# Altium project NGNIv1_32.PrjPcb
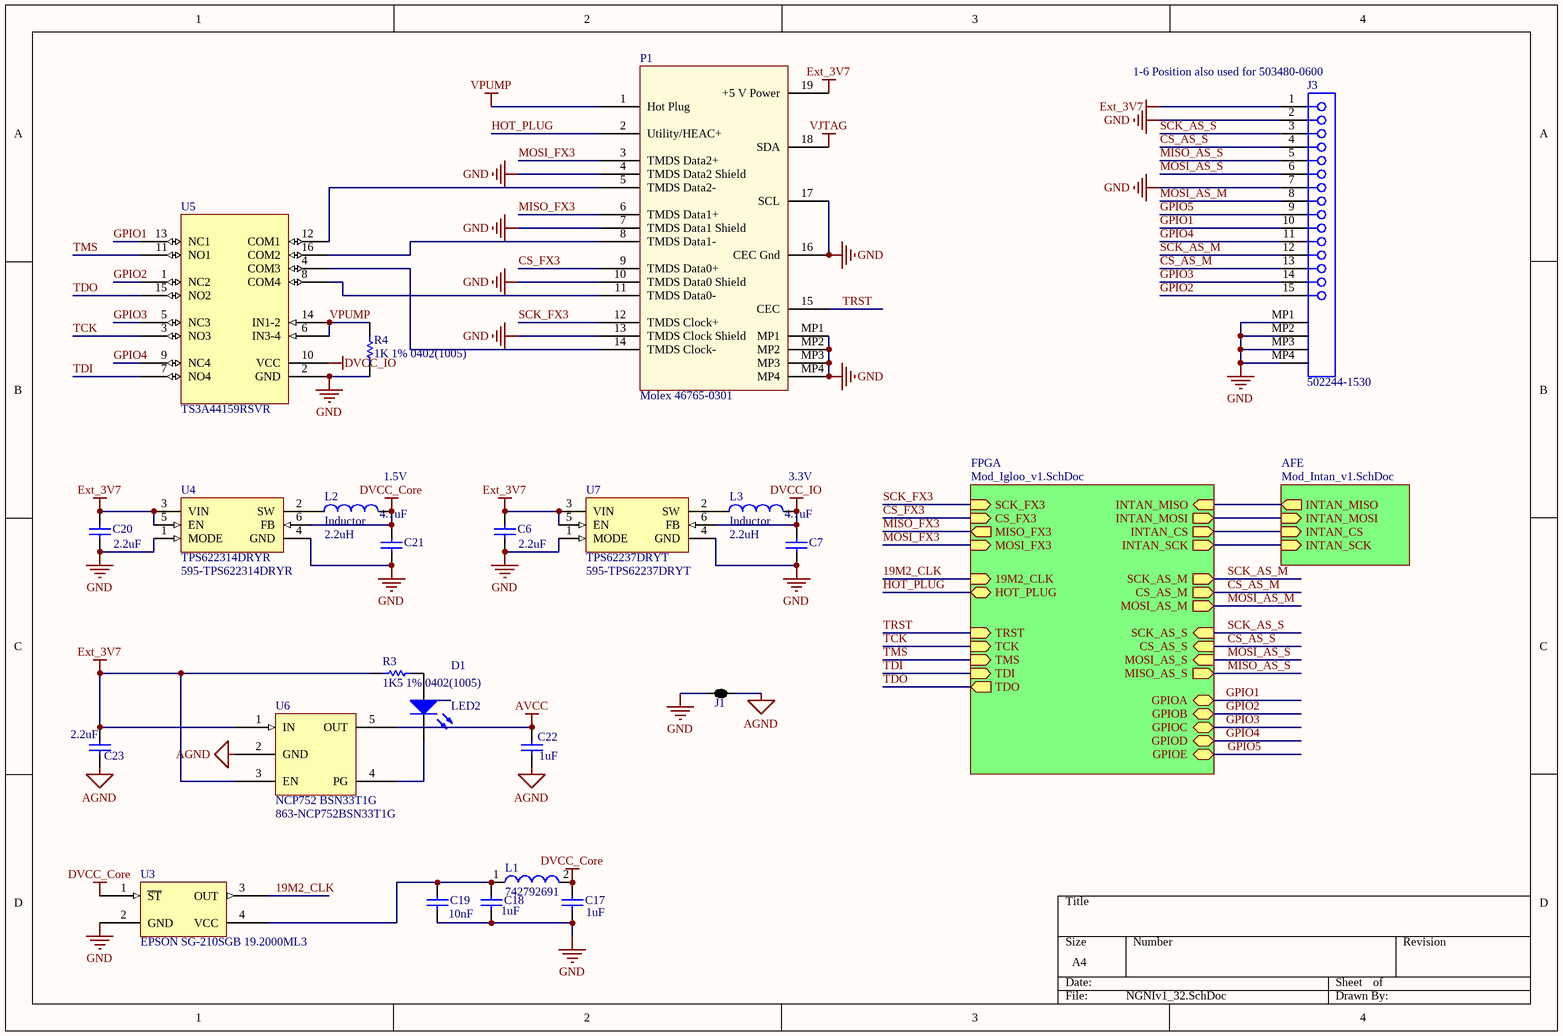
[diagram p0: NGNIv1_32.SchDoc]
3 sheets, 43 parts. Net scope: hierarchical (ports join the sheet entries above them; power ports are global).
Board file: NGNIv1_32.PcbDoc
Sheets:
  NGNIv1_32.SchDoc
    FPGA = Mod_Igloo_v1.SchDoc
    AFE = Mod_Intan_v1.SchDoc

## Sheet NGNIv1_32.SchDoc
size A4

### Parts
C6  value 2.2uF  [CAPC0402(1005)60_L]  (hidden comment: CAP 2.2uF 10V 0402(1005))
C7  value 4.7uF  [CAPC0402(1005)60_N]  (hidden comment: CAP 4.7uF 6.3V 0402(1005))
C17  value 1uF  [CAPC0402(1005)60_L]  (hidden comment: CAP 1uF 16V 0402(1005))
C18  value 1uF  [CAPC0402(1005)60_L]  (hidden comment: CAP 1uF 16V 0402(1005))
C19  value 10nF  [CAPC0402(1005)60_L]  (hidden comment: CAP 10nF 25V 0402(1005))
C20  value 2.2uF  [CAPC0402(1005)60_L]  (hidden comment: CAP 2.2uF 10V 0402(1005))
C21  value 4.7uF  [CAPC0402(1005)60_N]  (hidden comment: CAP 4.7uF 6.3V 0402(1005))
C22  value 1uF  [CAPC0402(1005)60_L]  (hidden comment: CAP 1uF 16V 0402(1005))
C23  value 2.2uF  [CAPC0603(1608)100_L]  (hidden comment: CAP 2.2uF 25V 0603(1608))
D1  LED2  [LED 0610]
J1  2 way net tie junction  [2way_micro]  (value not drawn)  (net tie, no BOM)
J3  502244-1530  [MOLX-502244-1530]
L1  742792691  [SMD-0603]
L2  Inductor  value 2.2uH  [2029]
L3  Inductor  value 2.2uH  [2029]
P1  Molex 46765-0301  [MOLEX 0467650301]
R3  1K5 1% 0402(1005)  [RESC0402(1005)_L]
R4  1K 1% 0402(1005)  [RESC0402(1005)_L]
U3  EPSON SG-210SGB 19.2000ML3  [SG-210S*B]
U4  TPS622314DRYR  Supplier Part Number 1: 595-TPS622314DRYR  [DRY0006A]
U5  TS3A44159RSVR  [UQFN-4]
U6  NCP752 BSN33T1G  Supplier Part Number 1: 863-NCP752BSN33T1G  [TSOP5 NCP752]
U7  TPS62237DRYT  Supplier Part Number 1: 595-TPS62237DRYT  [DRY0006A]

### Sub-sheets
AFE = Mod_Intan_v1.SchDoc: INTAN_MISO (out), INTAN_MOSI (in), INTAN_CS (in), INTAN_SCK (in)
FPGA = Mod_Igloo_v1.SchDoc: CS_AS_M (out), SCK_AS_S (in), HOT_PLUG, SCK_AS_M (out), CS_AS_S (in), SCK_FX3 (in), MISO_FX3 (out), MOSI_AS_S (in), INTAN_MOSI (out), 19M2_CLK (in), MOSI_AS_M (out), MISO_AS_S (out), INTAN_MISO (in), TRST (in), MOSI_FX3 (in), TDO (out), TMS (in), CS_FX3 (in), TCK (in), INTAN_CS (out), INTAN_SCK (out), TDI (in), GPIOA, GPIOC, GPIOE, GPIOB, GPIOD

### Nets
AGND: C22.1 C23.1 J1.2 U6.2(GND)
AVCC: C22.2 U6.5(OUT)
DVCC_Core: C17.2 C21.1 L1.2 L2.2 U3.1(~{ST}) U4.6(FB)
DVCC_IO: C7.1 L3.2 U5.10(VCC) U7.6(FB)
Ext_3V7: C6.2 C20.2 C23.2 J3.1 P1.19(+5_V_Power) R3.1 U4.3(VIN) U4.5(EN) U6.1(IN) U6.3(EN) U7.3(VIN) U7.5(EN)
GND: C6.1 C7.2 C17.1 C18.1 C19.1 C20.1 C21.2 J1.1 J3.2 J3.7 J3.MP1 J3.MP2 J3.MP3 J3.MP4 P1.4(TMDS_Data2_Shield) P1.7(TMDS_Data1_Shield) P1.10(TMDS_Data0_Shield) P1.13(TMDS_Clock_Shield) P1.16(CEC_Gnd) P1.17(SCL) P1.MP1 P1.MP2 P1.MP3 P1.MP4 R4.2 U3.2(GND) U4.1(MODE) U4.4(GND) U5.2(GND) U7.1(MODE) U7.4(GND)
VJTAG: P1.18(SDA)
VPUMP: P1.1(Hot_Plug) R4.1 U5.6(IN3-4) U5.14(IN1-2)
19M2_CLK: U3.3(OUT) ; sheet FPGA/19M2_CLK
CS_AS_M: J3.13 ; sheet FPGA/CS_AS_M
CS_AS_S: J3.4 ; sheet FPGA/CS_AS_S
CS_FX3: P1.9(TMDS_Data0+) ; sheet FPGA/CS_FX3
GPIO1: J3.10 U5.13(NC1) ; sheet FPGA/GPIOA
GPIO2: J3.15 U5.1(NC2) ; sheet FPGA/GPIOB
GPIO3: J3.14 U5.5(NC3) ; sheet FPGA/GPIOC
GPIO4: J3.11 U5.9(NC4) ; sheet FPGA/GPIOD
GPIO5: J3.9 ; sheet FPGA/GPIOE
HOT_PLUG: P1.2(Utility/HEAC+) ; sheet FPGA/HOT_PLUG
INTAN_CS: sheet FPGA/INTAN_CS, sheet AFE/INTAN_CS
INTAN_MISO: sheet FPGA/INTAN_MISO, sheet AFE/INTAN_MISO
INTAN_MOSI: sheet FPGA/INTAN_MOSI, sheet AFE/INTAN_MOSI
INTAN_SCK: sheet FPGA/INTAN_SCK, sheet AFE/INTAN_SCK
MISO_AS_S: J3.5 ; sheet FPGA/MISO_AS_S
MISO_FX3: P1.6(TMDS_Data1+) ; sheet FPGA/MISO_FX3
MOSI_AS_M: J3.8 ; sheet FPGA/MOSI_AS_M
MOSI_AS_S: J3.6 ; sheet FPGA/MOSI_AS_S
MOSI_FX3: P1.3(TMDS_Data2+) ; sheet FPGA/MOSI_FX3
SCK_AS_M: J3.12 ; sheet FPGA/SCK_AS_M
SCK_AS_S: J3.3 ; sheet FPGA/SCK_AS_S
SCK_FX3: P1.12(TMDS_Clock+) ; sheet FPGA/SCK_FX3
TCK: U5.3(NO3) ; sheet FPGA/TCK
TDI: U5.7(NO4) ; sheet FPGA/TDI
TDO: U5.15(NO2) ; sheet FPGA/TDO
TMS: U5.11(NO1) ; sheet FPGA/TMS
TRST: P1.15(CEC) ; sheet FPGA/TRST
NetC18_2: C18.2 C19.2 L1.1 U3.4(VCC)
NetD1_1: D1.1(A) R3.2
NetD1_2: D1.2(K) U6.4(PG)
NetL2_1: L2.1 U4.2(SW)
NetL3_1: L3.1 U7.2(SW)
NetP1_5: P1.5(TMDS_Data2-) U5.12(COM1)
NetP1_8: P1.8(TMDS_Data1-) U5.16(COM2)
NetP1_11: P1.11(TMDS_Data0-) U5.8(COM4)
NetP1_14: P1.14(TMDS_Clock-) U5.4(COM3)

### Notes on the sheet
- (near J3) 1-6 Position also used for 503480-0600
- (near L2) 1.5V
- (near L3) 3.3V

### Library data of the parts
C6 C20 = CMP-1034-02128-1: CAP 2.2uF 10V Â±20% 0402 (1005 Metric) Thickness 0.6mm SMD; Case-Metric: 1005; Case-EIA: 0402; Rated Voltage: 10 V; Max Thickness: 0.6 mm; Technology: SMT; Tolerance: Â±20%
C7 C21 = CMP-1034-02137-1: CAP 4.7uF 6.3V Â±20% 0402 (1005 Metric) Thickness 0.6mm SMD; Case-Metric: 1005; Case-EIA: 0402; Technology: SMT; Max Thickness: 0.6 mm; Tolerance: Â±20%; Rated Voltage: 6.3 V
C17 = CMP-1034-02119-1: CAP 1uF 16V Â±10% 0402 (1005 Metric) Thickness 0.6mm SMD; Case-EIA: 0402; Case-Metric: 1005; Max Thickness: 0.6 mm; Tolerance: Â±10%; Rated Voltage: 16 V; Technology: SMT
C18 = CMP-1034-02120-1: CAP 1uF 16V Â±20% 0402 (1005 Metric) Thickness 0.6mm SMD; Case-EIA: 0402; Case-Metric: 1005; Max Thickness: 0.6 mm; Tolerance: Â±20%; Rated Voltage: 16 V; Technology: SMT
C19 = CMP-1034-01879-1: CAP 10nF 25V ±5% 0402 (1005 Metric) Thickness 0.6mm SMD; Case-Metric: 1005; Case-EIA: 0402; Max Thickness: 0.6 mm; Rated Voltage: 25 V; Tolerance: ±5%; Technology: SMT
C22 = CMP-1034-02119-1: CAP 1uF 16V ±10% 0402 (1005 Metric) Thickness 0.6mm SMD; Case-Metric: 1005; Technology: SMT; Tolerance: ±10%
C23 = CMP-1035-02767-1: CAP 2.2uF 25V ±10% 0603 (1608 Metric) Thickness 1mm SMD; Case-Metric: 1608; Technology: SMT; Tolerance: ±10%
D1 = LED2: Typical RED, GREEN, YELLOW, AMBER GaAs LED; Published: 8-Jun-2000; LatestRevisionDate: 17-Jul-2002; LatestRevisionNote: Re-released for DXP Platform.; PackageVersion: Feb-2002; PackageReference: 3.2X1.6X1.1; Publisher: Altium Limited; PackageDescription: SM LED; 2 Flat Leads
J1 = 2way: ComponentLink1URL: http://www.edatools.cz/addons; ComponentLink1Description: Source; FootprintNote: LP=12mil, MP=40mil, HP=120mil
J3 = MOLX-502244-1530
L1 = CMP-0220-00115-1: SMD EMI Suppression Ferrite Bead WE-CBF, Z = 1500 Ohm; DatasheetVersion: Dec-2005; ComponentLink1URL: http://www.we-online.com; PackageVersion: 2009; PackageDescription: Chip Inductor, 2-Leads, Body 1.6 x 0.8 mm; ComponentLink2URL: http://www.we-online.de/katalog/media/pdf/742792691.pdf; ComponentLink1Description: Manufacturer Link; ComponentLink2Description: Datasheet; Impedance: 1500 Ohm; PackageReference: SMD-0603
L2 L3 = Inductor: LQM21PN2R2; Code_IEC: 1005; Published: 8-Jun-2000; LatestRevisionDate: 29-May-2009; LatestRevisionNote: IPC-7351 Footprint Added.; PackageReference: 0402-A; Publisher: Altium Limited; PackageDescription: Chip Inductor; Code_JEITA: 0402
P1 = Molex 46765-0301: Micro HDMI
R3 = CMP-1011-00528-1: 1K5 0.063W 1% 0402 (1005 Metric)  SMD; Case-Metric: 1005; Value: 1500.00 Ohm; Case-EIA: 0402; Tolerance: 1 %; Power: 0.063 W; Technology: SMT
R4 = CMP-1011-00510-1: 1K 0.063W 1% 0402 (1005 Metric)  SMD; Value: 1000.00 Ohm; Case-Metric: 1005; Case-EIA: 0402; Technology: SMT; Tolerance: 1 %; Power: 0.063 W
U4 = TPS622314DRYR: Voltage Regulators - Switching Regulators 3MHz,500mA Step- Down Converter; Manufacturer: Texas Instruments; CompType: IC; PIN_COUNT: 6; Input Voltage: 2.05 V to 6 V; Input Voltage MAX: 6 V; Number of Outputs: 1 Output; Output Voltage: 1.5 V; Topology: Buck; Input Voltage MIN: 2.05 V; PartNumber: TPS622314DRY; PackageReference: DRY0006A; MountType: SMT; RoHS: Y; RefDes: RefDes; Type: DEV; Value: Value; Supplier 1: Mouser; Manufacturer Part Number: TPS622314DRYR; Category: Voltage Regulators - Switching Regulators; Stock 1: 0; Pricing 1: 5000=0.901 (AUD); Operating Temperature Range: - 40 C to + 85 C; Output Current: 500 mA; Package / Case: USON-6; Packaging: Reel; Series: TPS622314; Brand: Texas Instruments; Mounting Style: SMD/SMT; Switching Frequency: 3 MHz; Maximum Operating Temperature: + 85 C; Minimum Operating Temperature: - 40 C; Product Category: Converters - DC/DC; Standard Pack Qty: 5000; RoHS - Mouser: Y; Minimum Order Quantity: 5000; Reeling: True; ComponentLink1URL: http://www.mouser.com/ds/2/405/tps622314-448767.pdf; ComponentLink1Description: http://www.mouser.com/ds/2/405/tps622314-448767.pdf
U5 = TS3A44159RSVR: 0.45-Ω Quad SPDT Analog Switch 4-Channel 2:1 Multiplexer – Demultiplexer  With Two Controls
U6 = NCP752 BSN33T1G: 3.3V LDO 200ma ultra low quiescent current, ultra low noise; Supplier 1: Mouser
U7 = TPS62237DRYT: Voltage Regulators - Switching Regulators 3MHz,500mA Step- Down Converter; PartNumber: TPS622314DRY; Manufacturer: Texas Instruments; Manufacturer Part Number: TPS622314DRYR; CompType: IC; PIN_COUNT: 6; Input Voltage: 2.05 V to 6 V; Input Voltage MAX: 6 V; Number of Outputs: 1 Output; Output Voltage: 1.5 V; Topology: Buck; Input Voltage MIN: 2.05 V; PackageReference: DRY0006A; MountType: SMT; RoHS: Y; RefDes: RefDes; Type: DEV; Value: Value; Category: Voltage Regulators - Switching Regulators; Operating Temperature Range: - 40 C to + 85 C; Output Current: 500 mA; Package / Case: USON-6; Packaging: Reel; Series: TPS622314; Brand: Texas Instruments; Mounting Style: SMD/SMT; Switching Frequency: 3 MHz; Maximum Operating Temperature: + 85 C; Minimum Operating Temperature: - 40 C; Product Category: Converters - DC/DC; Standard Pack Qty: 5000; RoHS - Mouser: Y; Minimum Order Quantity: 5000; Reeling: True; ComponentLink1URL: http://www.mouser.com/ds/2/405/tps622314-448767.pdf; ComponentLink1Description: http://www.mouser.com/ds/2/405/tps622314-448767.pdf; Supplier 1: Mouser

## Sheet Mod_Igloo_v1.SchDoc
size A4
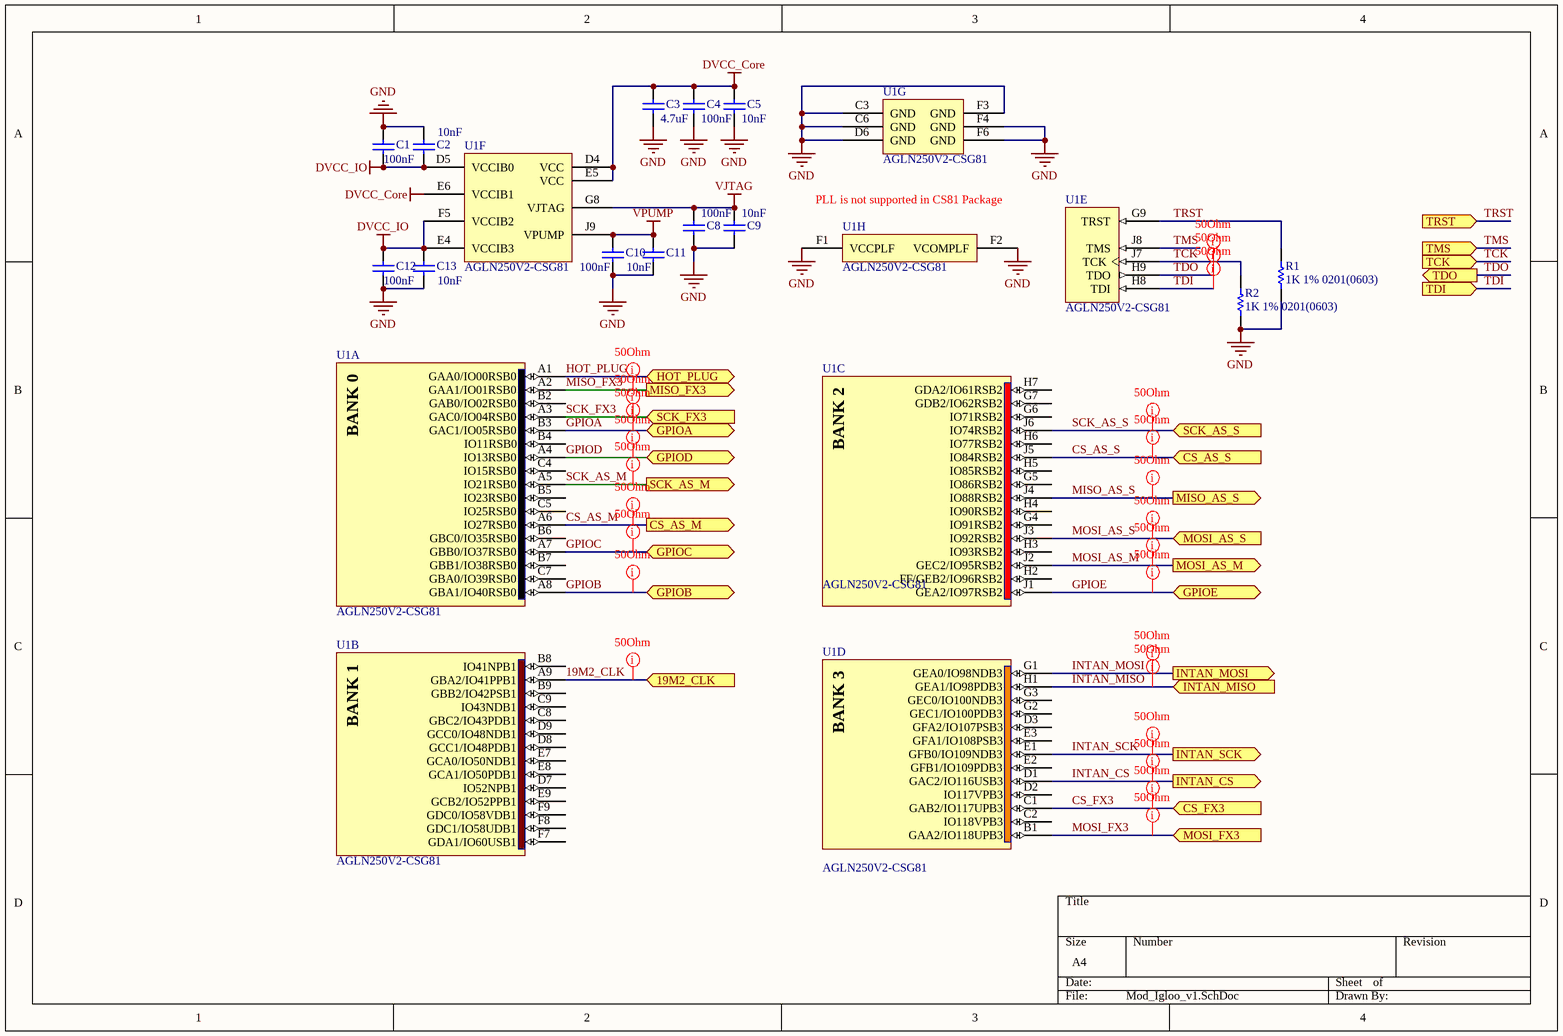
[diagram p1: Mod_Igloo_v1.SchDoc]

### Parts
(Parts that share a designator on the sheet are numbered #1, #2 ... from top to bottom, then left to right.)
C1  value 100nF  [CAPC0201(0603)33_N]  (hidden comment: CAP 100nF 16V 0201(0603))
C2  value 10nF  [CAPC0201(0603)33_L]  (hidden comment: CAP 10nF 16V 0201(0603))
C3  value 4.7uF  [CAPC0402(1005)60_N]  (hidden comment: CAP 4.7uF 6.3V 0402(1005))
C4  value 100nF  [CAPC0201(0603)33_N]  (hidden comment: CAP 100nF 16V 0201(0603))
C5  value 10nF  [CAPC0201(0603)33_L]  (hidden comment: CAP 10nF 16V 0201(0603))
C8  value 100nF  [CAPC0201(0603)33_N]  (hidden comment: CAP 100nF 16V 0201(0603))
C9  value 10nF  [CAPC0201(0603)33_L]  (hidden comment: CAP 10nF 16V 0201(0603))
C10  value 100nF  [CAPC0201(0603)33_N]  (hidden comment: CAP 100nF 16V 0201(0603))
C11  value 10nF  [CAPC0201(0603)33_L]  (hidden comment: CAP 10nF 16V 0201(0603))
C12  value 100nF  [CAPC0201(0603)33_N]  (hidden comment: CAP 100nF 16V 0201(0603))
C13  value 10nF  [CAPC0201(0603)33_L]  (hidden comment: CAP 10nF 16V 0201(0603))
R1  1K 1% 0201(0603)  [RESC0201(0603)_L]
R2  1K 1% 0201(0603)  [RESC0201(0603)_L]
U1#1  AGLN250V2-CSG81  [CS81]  (parts C,D,E of 8)
U1#2  AGLN250V2-CSG81  [CS81]  (parts A,B,F,G,H of 8)

### Ports
19M2_CLK (in), CS_AS_M (out), CS_AS_S (in), CS_FX3 (in), GPIOA, GPIOB, GPIOC, GPIOD, GPIOE, HOT_PLUG, INTAN_CS (out), INTAN_MISO (in), INTAN_MOSI (out), INTAN_SCK (out), MISO_AS_S (out), MISO_FX3 (out), MOSI_AS_M (out), MOSI_AS_S (in), MOSI_FX3 (in), SCK_AS_M (out), SCK_AS_S (in), SCK_FX3 (in), TCK (in), TDI (in), TDO (out), TMS (in), TRST (in)

### Nets
DVCC_Core: C3.1 C4.2 C5.2 U1#2.D4(VCC) U1#2.E5(VCC) U1#2.E6(VCCIB1)
DVCC_IO: C1.1 C2.1 C12.2 C13.1 U1#2.D5(VCCIB0) U1#2.E4(VCCIB3) U1#2.F5(VCCIB2)
GND: C1.2 C2.2 C3.2 C4.1 C5.1 C8.1 C9.1 C10.1 C11.1 C12.1 C13.2 R1.2 R2.2 U1#2.C3(GND) U1#2.C6(GND) U1#2.D6(GND) U1#2.F1(VCCPLF) U1#2.F2(VCOMPLF) U1#2.F3(GND) U1#2.F4(GND) U1#2.F6(GND)
VJTAG: C8.2 C9.2 U1#2.G8(VJTAG)
VPUMP: C10.2 C11.2 U1#2.J9(VPUMP)
19M2_CLK: U1#2.A9(GBA2/IO41PPB1) ; port 19M2_CLK
CS_AS_M: U1#2.A6(IO27RSB0) ; port CS_AS_M
CS_AS_S: U1#1.J5(IO84RSB2) ; port CS_AS_S
CS_FX3: U1#1.C1(GAB2/IO117UPB3) ; port CS_FX3
GPIOA: U1#2.B3(GAC1/IO05RSB0) ; port GPIOA  [project net GPIO1]
GPIOB: U1#2.A8(GBA1/IO40RSB0) ; port GPIOB  [project net GPIO2]
GPIOC: U1#2.A7(GBB0/IO37RSB0) ; port GPIOC  [project net GPIO3]
GPIOD: U1#2.A4(IO13RSB0) ; port GPIOD  [project net GPIO4]
GPIOE: U1#1.J1(GEA2/IO97RSB2) ; port GPIOE  [project net GPIO5]
HOT_PLUG: U1#2.A1(GAA0/IO00RSB0) ; port HOT_PLUG
INTAN_CS: U1#1.D1(GAC2/IO116USB3) ; port INTAN_CS
INTAN_MISO: U1#1.H1(GEA1/IO98PDB3) ; port INTAN_MISO
INTAN_MOSI: U1#1.G1(GEA0/IO98NDB3) ; port INTAN_MOSI
INTAN_SCK: U1#1.E1(GFB0/IO109NDB3) ; port INTAN_SCK
MISO_AS_S: U1#1.J4(IO88RSB2) ; port MISO_AS_S
MISO_FX3: U1#2.A2(GAA1/IO01RSB0) ; port MISO_FX3
MOSI_AS_M: U1#1.J2(GEC2/IO95RSB2) ; port MOSI_AS_M
MOSI_AS_S: U1#1.J3(IO92RSB2) ; port MOSI_AS_S
MOSI_FX3: U1#1.B1(GAA2/IO118UPB3) ; port MOSI_FX3
SCK_AS_M: U1#2.A5(IO21RSB0) ; port SCK_AS_M
SCK_AS_S: U1#1.J6(IO74RSB2) ; port SCK_AS_S
SCK_FX3: U1#2.A3(GAC0/IO04RSB0) ; port SCK_FX3
TCK: R2.1 U1#1.J7(TCK) ; port TCK
TDI: U1#1.H8(TDI) ; port TDI
TDO: U1#1.H9(TDO) ; port TDO
TMS: U1#1.J8(TMS) ; port TMS
TRST: R1.1 U1#1.G9(TRST) ; port TRST

Not connected (* = marked no-connect by the designer): U1#1 C2(IO118VPB3) D2(IO117VPB3) D3(GFA2/IO107PSB3) E2(GFB1/IO109PDB3) E3(GFA1/IO108PSB3) G2(GEC1/IO100PDB3) G3(GEC0/IO100NDB3) G4(IO91RSB2) G5(IO86RSB2) G6(IO71RSB2) G7(GDB2/IO62RSB2) H2(FF/GEB2/IO96RSB2) H3(IO93RSB2) H4(IO90RSB2) H5(IO85RSB2) H6(IO77RSB2) H7(GDA2/IO61RSB2); U1#2 B2(GAB0/IO02RSB0) B4(IO11RSB0) B5(IO23RSB0) B6(GBC0/IO35RSB0) B7(GBB1/IO38RSB0) B8(IO41NPB1) B9(GBB2/IO42PSB1) C4(IO15RSB0) C5(IO25RSB0) C7(GBA0/IO39RSB0) C8(GBC2/IO43PDB1) C9(IO43NDB1) D7(IO52NPB1) D8(GCC1/IO48PDB1) D9(GCC0/IO48NDB1) E7(GCA0/IO50NDB1) E8(GCA1/IO50PDB1) E9(GCB2/IO52PPB1) F7(GDA1/IO60USB1) F8(GDC1/IO58UDB1) F9(GDC0/IO58VDB1)

### Layout directives
net class 50Ohm: 19M2_CLK, CS_AS_M, CS_AS_S, CS_FX3, GPIO1, GPIO2, GPIO3, GPIO4, GPIO5, INTAN_CS, INTAN_MISO, INTAN_MOSI, INTAN_SCK, MISO_AS_S, MISO_FX3, MOSI_AS_M, MOSI_AS_S, MOSI_FX3, SCK_AS_M, SCK_AS_S, SCK_FX3, TCK, TDI, TDO

### Notes on the sheet
- (near U1#2) PLL is not supported in CS81 Package
- (in symbol CMP-0101-00037-1, part A) BANK 0
- (in symbol CMP-0101-00037-1, part B) BANK 1
- (in symbol CMP-0101-00037-1, part C) BANK 2
- (in symbol CMP-0101-00037-1, part D) BANK 3

### Library data of the parts
C1 C4 C8 C10 C12 = CMP-1033-00663-1: CAP 100nF 16V Â±10% 0201 (0603 Metric) Thickness 0.33mm SMD; Case-Metric: 0603; Case-EIA: 0201; Rated Voltage: 16 V; Max Thickness: 0.33 mm; Tolerance: Â±10%; Technology: SMT
C2 C5 C9 C11 C13 = CMP-1033-00642-1: CAP 10nF 16V Â±10% 0201 (0603 Metric) Thickness 0.33mm SMD; Case-Metric: 0603; Case-EIA: 0201; Technology: SMT; Tolerance: Â±10%; Max Thickness: 0.33 mm; Rated Voltage: 16 V
C3 = CMP-1034-02137-1: as C7 on sheet NGNIv1_32; Technology: SMT; Max Thickness: 0.6 mm; Tolerance: Â±20%; Rated Voltage: 6.3 V
R1 R2 = CMP-1010-00416-1: 1K 0.05W 1% 0201 (0603 Metric)  SMD; Value: 1000.00 Ohm; Case-Metric: 0603; Case-EIA: 0201; Technology: SMT; Tolerance: 1 %; Power: 0.05 W
U1#1 U1#2 = CMP-0101-00037-1: IGLOO nano Low-Power Flash 1.2 to 1.5V FPGA with Flash*Freeze, 60 User IOs, 250K System Gates, 1Kbit Flash ROM, 81-Pin CSP, Commercial Grade, Pb-Free; PackageVersion: ver11.2, Nov-2009; PackageReference: CS81; PackageDescription: 81-Ball Chip Scale Ball Grid Array 0.5 mm Pitch (CS81); Code_JEDEC: MO-195-AB; DatasheetVersion: v0.8, Jan-2010

## Sheet Mod_Intan_v1.SchDoc
size A4
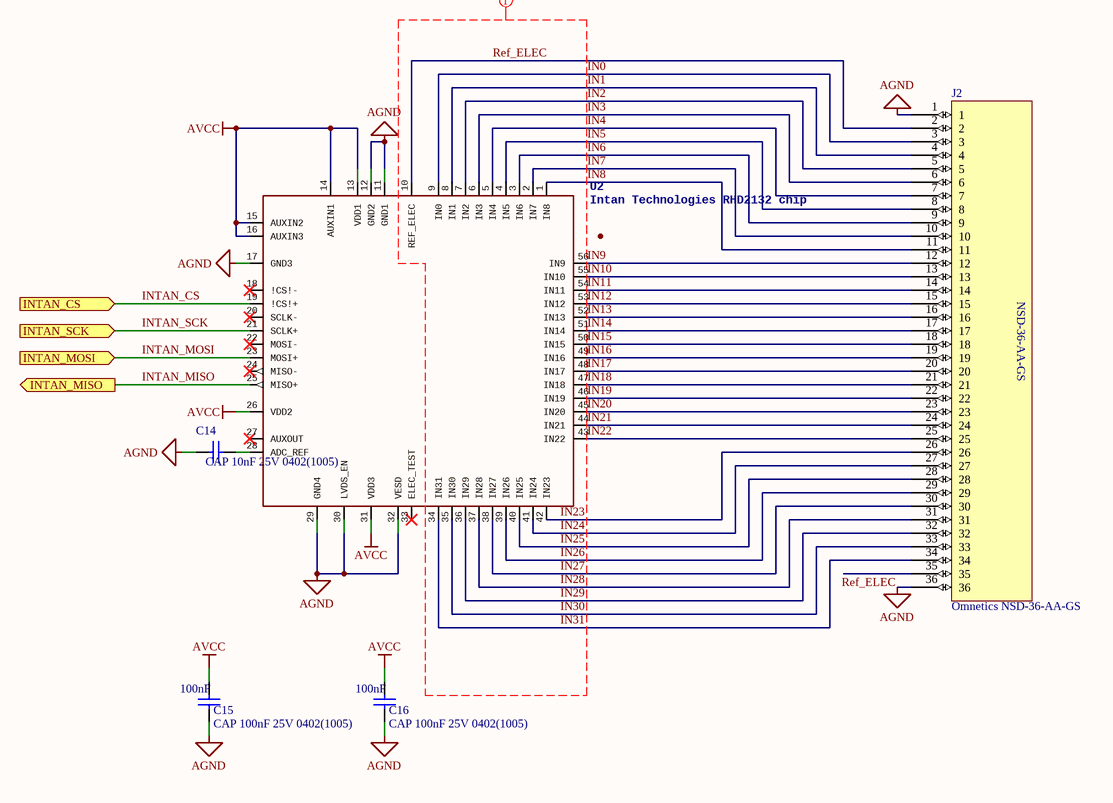
[diagram p2: Mod_Intan_v1.SchDoc]

### Parts
C14  CAP 10nF 25V 0402(1005)  [CAPC0402(1005)60_L]
C15  CAP 100nF 25V 0402(1005)  value 100nF  [CAPC0402(1005)60_L]
C16  CAP 100nF 25V 0402(1005)  value 100nF  [CAPC0402(1005)60_L]
J2  Omnetics NSD-36-AA-GS  [NSD-36-AA-GS]
U2  Intan Technologies RHD2132 chip  [QFN56_large]

### Ports
INTAN_CS (in), INTAN_MISO (out), INTAN_MOSI (in), INTAN_SCK (in)

### Nets
AGND: C14.1 C15.1 C16.1 J2.1 J2.36 U2.11(GND1) U2.12(GND2) U2.17(GND3) U2.29(GND4) U2.30(LVDS_EN) U2.32(VESD)
AVCC: C15.2 C16.2 U2.13(VDD1) U2.14(AUXIN1) U2.15(AUXIN2) U2.16(AUXIN3) U2.26(VDD2) U2.31(VDD3)
IN0: J2.3 U2.9(IN0)
IN1: J2.4 U2.8(IN1)
IN2: J2.5 U2.7(IN2)
IN3: J2.6 U2.6(IN3)
IN4: J2.7 U2.5(IN4)
IN5: J2.8 U2.4(IN5)
IN6: J2.9 U2.3(IN6)
IN7: J2.10 U2.2(IN7)
IN8: J2.11 U2.1(IN8)
IN9: J2.12 U2.56(IN9)
IN10: J2.13 U2.55(IN10)
IN11: J2.14 U2.54(IN11)
IN12: J2.15 U2.53(IN12)
IN13: J2.16 U2.52(IN13)
IN14: J2.17 U2.51(IN14)
IN15: J2.18 U2.50(IN15)
IN16: J2.19 U2.49(IN16)
IN17: J2.20 U2.48(IN17)
IN18: J2.21 U2.47(IN18)
IN19: J2.22 U2.46(IN19)
IN20: J2.23 U2.45(IN20)
IN21: J2.24 U2.44(IN21)
IN22: J2.25 U2.43(IN22)
IN23: J2.26 U2.42(IN23)
IN24: J2.27 U2.41(IN24)
IN25: J2.28 U2.40(IN25)
IN26: J2.29 U2.39(IN26)
IN27: J2.30 U2.38(IN27)
IN28: J2.31 U2.37(IN28)
IN29: J2.32 U2.36(IN29)
IN30: J2.33 U2.35(IN30)
IN31: J2.34 U2.34(IN31)
INTAN_CS: U2.19(!CS!+) ; port INTAN_CS
INTAN_MISO: U2.25(MISO+) ; port INTAN_MISO
INTAN_MOSI: U2.23(MOSI+) ; port INTAN_MOSI
INTAN_SCK: U2.21(SCLK+) ; port INTAN_SCK
Ref_ELEC: J2.2 J2.35 U2.10(REF_ELEC)
NetC14_2: C14.2 U2.28(ADC_REF)

Not connected (* = marked no-connect by the designer): U2 18(!CS!-)* 20(SCLK-)* 22(MOSI-)* 24(MISO-)* 27(AUXOUT)* 33(ELEC_TEST)*

### Layout directives
net class Undefined: IN0, IN1, IN2, IN3, IN4, IN5, IN6, IN7, IN8, IN9, IN10, IN11, IN12, IN13, IN14, IN15, IN16, IN17, IN18, IN19, IN20, IN21, IN22, IN23, IN24, IN25, IN26, IN27, IN28, IN29, IN30, IN31, Ref_ELEC

### Library data of the parts
C14 = CMP-1034-01879-1: as C19 on sheet NGNIv1_32; Value: 10nF; Tolerance: ±5%; Technology: SMT; Max Thickness: 0.6 mm; Rated Voltage: 25 V
C15 C16 = CMP-1034-02072-1: CAP 100nF 25V ±10% 0402 (1005 Metric) Thickness 0.6mm SMD; Case-Metric: 1005; Case-EIA: 0402; Technology: SMT; Tolerance: ±10%; Rated Voltage: 25 V; Max Thickness: 0.6 mm
J2 = Omnetics NSD-36-AA-GS: NSD-36-AA-GS; Part Number: A79025-001
U2 = RHD2132_QFN

## Nets that join several sheets
AGND: NGNIv1_32 (C22.1 C23.1 J1.2 U6.2), Mod_Intan_v1 (11 pins)
AVCC: NGNIv1_32 (C22.2 U6.5), Mod_Intan_v1 (8 pins)
DVCC_Core: NGNIv1_32 (6 pins), Mod_Igloo_v1 (6 pins)
DVCC_IO: NGNIv1_32 (C7.1 L3.2 U5.10 U7.6), Mod_Igloo_v1 (7 pins)
GND: NGNIv1_32 (31 pins), Mod_Igloo_v1 (21 pins)
VJTAG: NGNIv1_32 (P1.18), Mod_Igloo_v1 (C8.2 C9.2 U1#2.G8)
VPUMP: NGNIv1_32 (P1.1 R4.1 U5.6 U5.14), Mod_Igloo_v1 (C10.2 C11.2 U1#2.J9)
19M2_CLK: NGNIv1_32 (U3.3), Mod_Igloo_v1 (U1#2.A9)
CS_AS_M: NGNIv1_32 (J3.13), Mod_Igloo_v1 (U1#2.A6)
CS_AS_S: NGNIv1_32 (J3.4), Mod_Igloo_v1 (U1#1.J5)
CS_FX3: NGNIv1_32 (P1.9), Mod_Igloo_v1 (U1#1.C1)
GPIO1: NGNIv1_32 (J3.10 U5.13), Mod_Igloo_v1 (U1#2.B3)
GPIO2: NGNIv1_32 (J3.15 U5.1), Mod_Igloo_v1 (U1#2.A8)
GPIO3: NGNIv1_32 (J3.14 U5.5), Mod_Igloo_v1 (U1#2.A7)
GPIO4: NGNIv1_32 (J3.11 U5.9), Mod_Igloo_v1 (U1#2.A4)
GPIO5: NGNIv1_32 (J3.9), Mod_Igloo_v1 (U1#1.J1)
HOT_PLUG: NGNIv1_32 (P1.2), Mod_Igloo_v1 (U1#2.A1)
INTAN_CS: Mod_Igloo_v1 (U1#1.D1), Mod_Intan_v1 (U2.19)
INTAN_MISO: Mod_Igloo_v1 (U1#1.H1), Mod_Intan_v1 (U2.25)
INTAN_MOSI: Mod_Igloo_v1 (U1#1.G1), Mod_Intan_v1 (U2.23)
INTAN_SCK: Mod_Igloo_v1 (U1#1.E1), Mod_Intan_v1 (U2.21)
MISO_AS_S: NGNIv1_32 (J3.5), Mod_Igloo_v1 (U1#1.J4)
MISO_FX3: NGNIv1_32 (P1.6), Mod_Igloo_v1 (U1#2.A2)
MOSI_AS_M: NGNIv1_32 (J3.8), Mod_Igloo_v1 (U1#1.J2)
MOSI_AS_S: NGNIv1_32 (J3.6), Mod_Igloo_v1 (U1#1.J3)
MOSI_FX3: NGNIv1_32 (P1.3), Mod_Igloo_v1 (U1#1.B1)
SCK_AS_M: NGNIv1_32 (J3.12), Mod_Igloo_v1 (U1#2.A5)
SCK_AS_S: NGNIv1_32 (J3.3), Mod_Igloo_v1 (U1#1.J6)
SCK_FX3: NGNIv1_32 (P1.12), Mod_Igloo_v1 (U1#2.A3)
TCK: NGNIv1_32 (U5.3), Mod_Igloo_v1 (R2.1 U1#1.J7)
TDI: NGNIv1_32 (U5.7), Mod_Igloo_v1 (U1#1.H8)
TDO: NGNIv1_32 (U5.15), Mod_Igloo_v1 (U1#1.H9)
TMS: NGNIv1_32 (U5.11), Mod_Igloo_v1 (U1#1.J8)
TRST: NGNIv1_32 (P1.15), Mod_Igloo_v1 (R1.1 U1#1.G9)